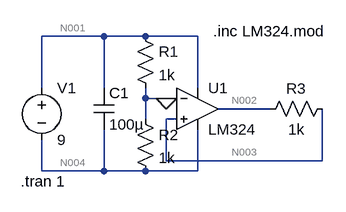
[diagram p0: schematic Draft2.asc]
Draft2.asc, the LTspice schematic file:
Version 4.1
SHEET 1 880 680
WIRE 96 16 0 16
WIRE 160 16 96 16
WIRE 240 16 160 16
WIRE 0 96 0 16
WIRE 96 96 96 16
WIRE 240 96 240 16
WIRE 160 112 160 96
WIRE 192 112 160 112
WIRE 208 112 192 112
WIRE 352 128 272 128
WIRE 160 144 160 112
WIRE 208 144 192 144
WIRE 192 208 192 144
WIRE 432 208 432 128
WIRE 432 208 192 208
WIRE 0 224 0 176
WIRE 96 224 96 160
WIRE 96 224 0 224
WIRE 160 224 96 224
WIRE 240 224 240 160
WIRE 240 224 160 224
FLAG 192 112 0
SYMBOL OpAmps\\opamp2 240 64 R0
SYMATTR InstName U1
SYMATTR Value LM324
SYMBOL voltage 0 80 R0
WINDOW 123 0 0 Left 0
WINDOW 39 0 0 Left 0
SYMATTR InstName V1
SYMATTR Value 9
SYMBOL cap 80 96 R0
SYMATTR InstName C1
SYMATTR Value 100µ
SYMBOL res 144 0 R0
SYMATTR InstName R1
SYMATTR Value 1k
SYMBOL res 144 128 R0
SYMATTR InstName R2
SYMATTR Value 1k
SYMBOL res 448 112 R90
WINDOW 0 0 56 VBottom 2
WINDOW 3 32 56 VTop 2
SYMATTR InstName R3
SYMATTR Value 1k
TEXT 264 8 Left 2 !.inc LM324.mod
TEXT -32 240 Left 2 !.tran 1

The netlist it stands for:
* Draft2.asc
X§U1 N003 0 N001 N004 N002 LM324  ; pins In+ In- V+ V- OUT
V1 N001 N004 9
C1 N001 N004 100µ
R1 N001 0 1k
R2 0 N004 1k
R3 N003 N002 1k
.inc LM324.mod
.tran 1
.backanno
.end

* Results of the author's LTspice run, read from the files saved beside the schematic
* Operating Point, zero values left out:
*   V(n001) = 4.5 V
*   V(n002) = -4.481 V
*   V(n003) = -4.481 V
*   V(n004) = -4.5 V
*   I(R2) = 4.5 mA
*   I(V1) = -5.187 mA
*   I(R3) = 39.09 nA
*   I(R1) = 4.5 mA
*   Ix(u1:1) = -39.09 nA
*   Ix(u1:2) = 7.146 pA
*   Ix(u1:3) = 686.7 µA
*   Ix(u1:4) = -686.7 µA
*   Ix(u1:5) = 39.09 nA